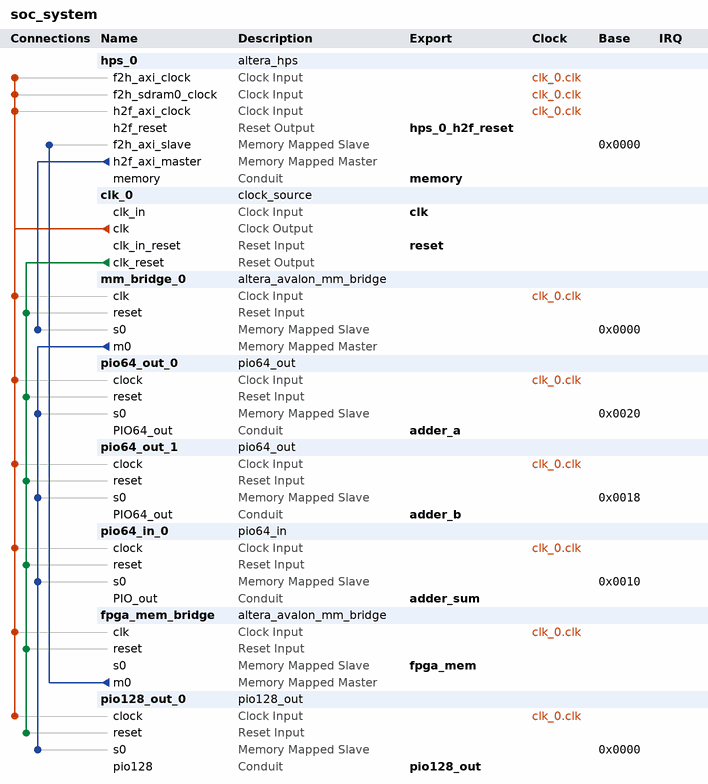
[diagram p0: system contents]
# Platform Designer (Qsys) system soc_system, Cyclone V 5CSEBA6U23I7
# Parameters at their usual value, and those the tool derives, are not listed.
package require -exact qsys 25.1
create_system soc_system
set_project_property DEVICE_FAMILY {Cyclone V}
set_project_property DEVICE 5CSEBA6U23I7

add_instance hps_0 altera_hps 25.1
set_instance_parameter_value hps_0 EMAC1_Mode N/A
set_instance_parameter_value hps_0 EMAC1_PinMuxing Unused
set_instance_parameter_value hps_0 F2SCLK_COLDRST_Enable false
set_instance_parameter_value hps_0 F2SCLK_DBGRST_Enable false
set_instance_parameter_value hps_0 F2SCLK_WARMRST_Enable false
set_instance_parameter_value hps_0 F2SDRAM_Type AXI-3
set_instance_parameter_value hps_0 F2SDRAM_Width 64
set_instance_parameter_value hps_0 F2SINTERRUPT_Enable true
set_instance_parameter_value hps_0 F2S_Width 2
set_instance_parameter_value hps_0 FPGA_PERIPHERAL_OUTPUT_CLOCK_FREQ_EMAC0_GTX_CLK 100
set_instance_parameter_value hps_0 FPGA_PERIPHERAL_OUTPUT_CLOCK_FREQ_EMAC0_MD_CLK 100.0
set_instance_parameter_value hps_0 FPGA_PERIPHERAL_OUTPUT_CLOCK_FREQ_EMAC1_GTX_CLK 100
set_instance_parameter_value hps_0 FPGA_PERIPHERAL_OUTPUT_CLOCK_FREQ_EMAC1_MD_CLK 100.0
set_instance_parameter_value hps_0 HPS_PROTOCOL DDR3
set_instance_parameter_value hps_0 I2C0_Mode N/A
set_instance_parameter_value hps_0 I2C0_PinMuxing Unused
set_instance_parameter_value hps_0 I2C1_Mode N/A
set_instance_parameter_value hps_0 I2C1_PinMuxing Unused
set_instance_parameter_value hps_0 LWH2F_Enable false
set_instance_parameter_value hps_0 MEM_BANKADDR_WIDTH 3
set_instance_parameter_value hps_0 MEM_CLK_FREQ 400.0
set_instance_parameter_value hps_0 MEM_COL_ADDR_WIDTH 10
set_instance_parameter_value hps_0 MEM_DQ_WIDTH 32
set_instance_parameter_value hps_0 MEM_DRV_STR RZQ/6
set_instance_parameter_value hps_0 MEM_ROW_ADDR_WIDTH 15
set_instance_parameter_value hps_0 MEM_RTT_NOM RZQ/6
set_instance_parameter_value hps_0 MEM_RTT_WR {Dynamic ODT off}
set_instance_parameter_value hps_0 MEM_TCL 7
set_instance_parameter_value hps_0 MEM_TFAW_NS 37.5
set_instance_parameter_value hps_0 MEM_TRAS_NS 35.0
set_instance_parameter_value hps_0 MEM_TRCD_NS 13.75
set_instance_parameter_value hps_0 MEM_TRFC_NS 300.0
set_instance_parameter_value hps_0 MEM_TRP_NS 13.75
set_instance_parameter_value hps_0 MEM_VENDOR Other
set_instance_parameter_value hps_0 MEM_WTCL 7
set_instance_parameter_value hps_0 QSPI_Mode N/A
set_instance_parameter_value hps_0 QSPI_PinMuxing Unused
set_instance_parameter_value hps_0 REF_CLK_FREQ 25.0
set_instance_parameter_value hps_0 S2FCLK_USER2CLK 4
set_instance_parameter_value hps_0 S2F_Width 2
set_instance_parameter_value hps_0 SDIO_Mode N/A
set_instance_parameter_value hps_0 SDIO_PinMuxing Unused
set_instance_parameter_value hps_0 SPIM1_Mode N/A
set_instance_parameter_value hps_0 SPIM1_PinMuxing Unused
set_instance_parameter_value hps_0 STM_Enable false
set_instance_parameter_value hps_0 TIMING_BOARD_AC_SKEW 0.02
set_instance_parameter_value hps_0 TIMING_BOARD_AC_TO_CK_SKEW 0.0
set_instance_parameter_value hps_0 TIMING_BOARD_DQ_TO_DQS_SKEW 0.0
set_instance_parameter_value hps_0 TIMING_BOARD_MAX_CK_DELAY 0.6
set_instance_parameter_value hps_0 TIMING_BOARD_MAX_DQS_DELAY 0.6
set_instance_parameter_value hps_0 TIMING_BOARD_SKEW_BETWEEN_DQS 0.02
set_instance_parameter_value hps_0 TIMING_BOARD_SKEW_CKDQS_DIMM_MAX 0.01
set_instance_parameter_value hps_0 TIMING_BOARD_SKEW_CKDQS_DIMM_MIN -0.01
set_instance_parameter_value hps_0 TIMING_BOARD_SKEW_WITHIN_DQS 0.02
set_instance_parameter_value hps_0 TIMING_TDH 125
set_instance_parameter_value hps_0 TIMING_TDQSCK 400
set_instance_parameter_value hps_0 TIMING_TDQSQ 120
set_instance_parameter_value hps_0 TIMING_TDS 50
set_instance_parameter_value hps_0 TIMING_TIH 250
set_instance_parameter_value hps_0 TIMING_TIS 175
set_instance_parameter_value hps_0 TIMING_TQSH 0.38
set_instance_parameter_value hps_0 UART0_Mode N/A
set_instance_parameter_value hps_0 UART0_PinMuxing Unused
set_instance_parameter_value hps_0 USB1_Mode N/A
set_instance_parameter_value hps_0 USB1_PinMuxing Unused
set_instance_parameter_value hps_0 desired_cfg_clk_mhz 100.0
set_instance_parameter_value hps_0 desired_qspi_clk_mhz 370.0

add_instance clk_0 clock_source 25.1
set_instance_parameter_value clk_0 clockFrequency 50000000

add_instance mm_bridge_0 altera_avalon_mm_bridge 25.1
set_instance_parameter_value mm_bridge_0 ADDRESS_UNITS SYMBOLS
set_instance_parameter_value mm_bridge_0 ADDRESS_WIDTH 10
set_instance_parameter_value mm_bridge_0 DATA_WIDTH 64
set_instance_parameter_value mm_bridge_0 MAX_PENDING_RESPONSES 4
set_instance_parameter_value mm_bridge_0 USE_AUTO_ADDRESS_WIDTH 1

add_instance pio64_out_0 pio64_out 1.0

add_instance pio64_out_1 pio64_out 1.0

add_instance pio64_in_0 pio64_in 1.0

add_instance fpga_mem_bridge altera_avalon_mm_bridge 25.1
set_instance_parameter_value fpga_mem_bridge ADDRESS_UNITS SYMBOLS
set_instance_parameter_value fpga_mem_bridge ADDRESS_WIDTH 32
set_instance_parameter_value fpga_mem_bridge DATA_WIDTH 64
set_instance_parameter_value fpga_mem_bridge MAX_PENDING_RESPONSES 4
set_instance_parameter_value fpga_mem_bridge USE_AUTO_ADDRESS_WIDTH 0

add_instance pio128_out_0 pio128_out 1.0

# connections
add_connection clk_0.clk fpga_mem_bridge.clk clock
add_connection clk_0.clk hps_0.f2h_axi_clock clock
add_connection clk_0.clk hps_0.f2h_sdram0_clock clock
add_connection clk_0.clk hps_0.h2f_axi_clock clock
add_connection clk_0.clk mm_bridge_0.clk clock
add_connection clk_0.clk pio64_in_0.clock clock
add_connection clk_0.clk pio64_out_0.clock clock
add_connection clk_0.clk pio64_out_1.clock clock
add_connection clk_0.clk pio128_out_0.clock clock
add_connection clk_0.clk_reset fpga_mem_bridge.reset reset
add_connection clk_0.clk_reset mm_bridge_0.reset reset
add_connection clk_0.clk_reset pio64_in_0.reset reset
add_connection clk_0.clk_reset pio64_out_0.reset reset
add_connection clk_0.clk_reset pio64_out_1.reset reset
add_connection clk_0.clk_reset pio128_out_0.reset reset
add_connection fpga_mem_bridge.m0 hps_0.f2h_axi_slave avalon
set_connection_parameter_value fpga_mem_bridge.m0/hps_0.f2h_axi_slave baseAddress 0x0000
add_connection hps_0.h2f_axi_master mm_bridge_0.s0 avalon
set_connection_parameter_value hps_0.h2f_axi_master/mm_bridge_0.s0 baseAddress 0x0000
add_connection mm_bridge_0.m0 pio64_in_0.s0 avalon
set_connection_parameter_value mm_bridge_0.m0/pio64_in_0.s0 baseAddress 0x0010
add_connection mm_bridge_0.m0 pio64_out_0.s0 avalon
set_connection_parameter_value mm_bridge_0.m0/pio64_out_0.s0 baseAddress 0x0020
add_connection mm_bridge_0.m0 pio64_out_1.s0 avalon
set_connection_parameter_value mm_bridge_0.m0/pio64_out_1.s0 baseAddress 0x0018
add_connection mm_bridge_0.m0 pio128_out_0.s0 avalon
set_connection_parameter_value mm_bridge_0.m0/pio128_out_0.s0 baseAddress 0x0000

# exported interfaces
add_interface adder_a conduit end
set_interface_property adder_a EXPORT_OF pio64_out_0.PIO64_out
add_interface adder_b conduit end
set_interface_property adder_b EXPORT_OF pio64_out_1.PIO64_out
add_interface adder_sum conduit end
set_interface_property adder_sum EXPORT_OF pio64_in_0.PIO_out
add_interface clk clock sink
set_interface_property clk EXPORT_OF clk_0.clk_in
add_interface fpga_mem avalon slave
set_interface_property fpga_mem EXPORT_OF fpga_mem_bridge.s0
add_interface hps_0_h2f_reset reset source
set_interface_property hps_0_h2f_reset EXPORT_OF hps_0.h2f_reset
add_interface memory conduit end
set_interface_property memory EXPORT_OF hps_0.memory
add_interface pio128_out conduit end
set_interface_property pio128_out EXPORT_OF pio128_out_0.pio128
add_interface reset reset sink
set_interface_property reset EXPORT_OF clk_0.clk_in_reset

set_interconnect_requirement {$system} qsys_mm.clockCrossingAdapter HANDSHAKE
set_interconnect_requirement {$system} qsys_mm.maxAdditionalLatency 1

save_system soc_system.qsys
